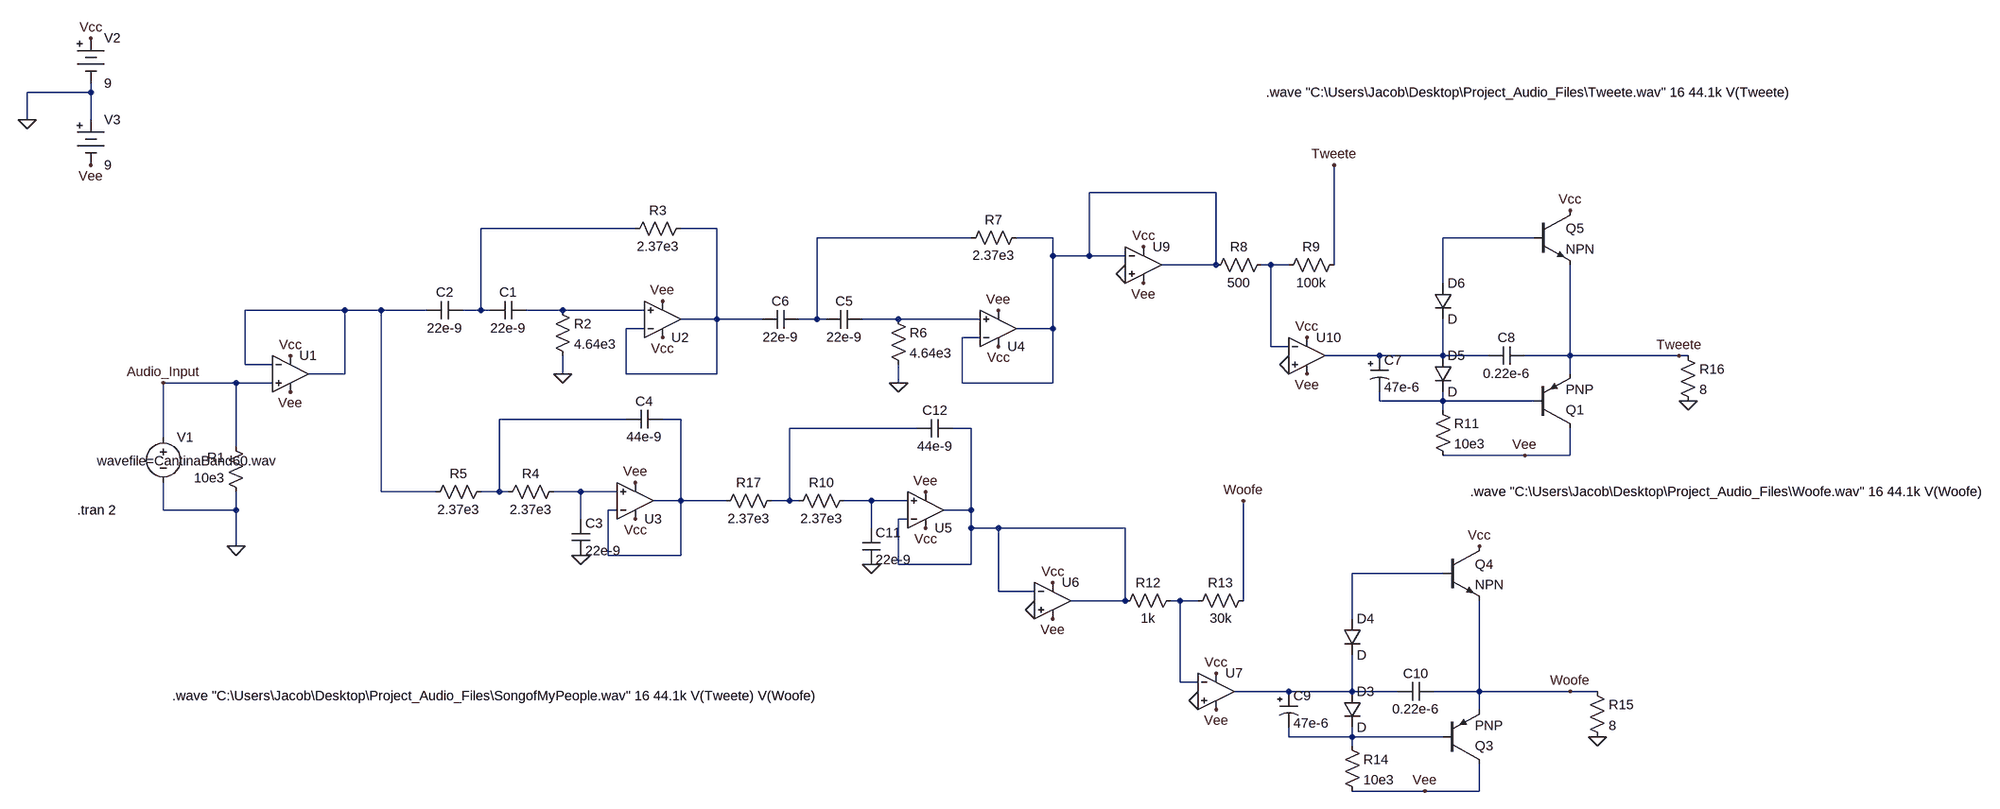
[diagram p0: schematic FinalDesign.asc]
FinalDesign.asc, the LTspice schematic file:
Version 4
SHEET 1 4260 1156
WIRE -96 -288 -96 -304
WIRE -96 -288 -208 -288
WIRE -208 -240 -208 -288
WIRE -96 -240 -96 -288
WIRE 1888 -112 1664 -112
WIRE 864 -48 592 -48
WIRE 1008 -48 944 -48
WIRE 1456 -32 1184 -32
WIRE 1600 -32 1536 -32
WIRE 2448 -32 2288 -32
WIRE 1600 0 1600 -32
WIRE 1664 0 1664 -112
WIRE 1664 0 1600 0
WIRE 1728 0 1664 0
WIRE 1888 16 1888 -112
WIRE 1888 16 1792 16
WIRE 1984 16 1968 16
WIRE 2016 16 1984 16
WIRE 2096 16 2096 -160
WIRE 2288 48 2288 -32
WIRE 352 96 176 96
WIRE 416 96 352 96
WIRE 496 96 416 96
WIRE 592 96 592 -48
WIRE 592 96 560 96
WIRE 608 96 592 96
WIRE 736 96 672 96
WIRE 880 96 736 96
WIRE 1008 112 1008 -48
WIRE 1008 112 944 112
WIRE 1088 112 1008 112
WIRE 1184 112 1184 -32
WIRE 1184 112 1152 112
WIRE 1200 112 1184 112
WIRE 1328 112 1264 112
WIRE 1472 112 1328 112
WIRE 880 128 848 128
WIRE 1600 128 1600 0
WIRE 1600 128 1536 128
WIRE 1472 144 1440 144
WIRE 1984 160 1984 16
WIRE 2016 160 1984 160
WIRE 2176 176 2080 176
WIRE 2288 176 2288 112
WIRE 2288 176 2176 176
WIRE 2368 176 2288 176
WIRE 2512 176 2512 16
WIRE 2512 176 2432 176
WIRE 2704 176 2512 176
WIRE 2720 176 2704 176
WIRE 176 192 176 96
WIRE 224 192 176 192
WIRE 352 208 352 96
WIRE 352 208 288 208
WIRE 736 208 736 176
WIRE 848 208 848 128
WIRE 1008 208 1008 112
WIRE 1008 208 848 208
WIRE 2512 208 2512 176
WIRE 160 224 32 224
WIRE 224 224 160 224
WIRE 1328 224 1328 192
WIRE 1440 224 1440 144
WIRE 1600 224 1600 128
WIRE 1600 224 1440 224
WIRE 2176 256 2176 240
WIRE 2288 256 2288 240
WIRE 2288 256 2176 256
WIRE 2448 256 2288 256
WIRE 2288 272 2288 256
WIRE 848 288 624 288
WIRE 944 288 912 288
WIRE 1360 304 1136 304
WIRE 1456 304 1424 304
WIRE 32 320 32 224
WIRE 160 336 160 224
WIRE 2432 352 2288 352
WIRE 2512 352 2512 304
WIRE 2512 352 2432 352
WIRE 416 416 416 96
WIRE 512 416 416 416
WIRE 624 416 624 288
WIRE 624 416 592 416
WIRE 640 416 624 416
WIRE 768 416 720 416
WIRE 832 416 768 416
WIRE 944 432 944 288
WIRE 944 432 896 432
WIRE 1024 432 944 432
WIRE 1136 432 1136 304
WIRE 1136 432 1104 432
WIRE 1152 432 1136 432
WIRE 1280 432 1232 432
WIRE 1344 432 1280 432
WIRE 32 448 32 400
WIRE 160 448 160 416
WIRE 160 448 32 448
WIRE 832 448 816 448
WIRE 1456 448 1456 304
WIRE 1456 448 1408 448
WIRE 768 464 768 416
WIRE 1344 464 1328 464
WIRE 1280 480 1280 432
WIRE 1456 480 1456 448
WIRE 1504 480 1456 480
WIRE 1728 480 1504 480
WIRE 160 512 160 448
WIRE 816 528 816 448
WIRE 944 528 944 432
WIRE 944 528 816 528
WIRE 1328 544 1328 464
WIRE 1456 544 1456 480
WIRE 1456 544 1328 544
WIRE 2288 560 2128 560
WIRE 1504 592 1504 480
WIRE 1568 592 1504 592
WIRE 1728 608 1728 480
WIRE 1728 608 1632 608
WIRE 1824 608 1808 608
WIRE 1856 608 1824 608
WIRE 1936 608 1936 432
WIRE 2128 640 2128 560
WIRE 1824 752 1824 608
WIRE 1856 752 1824 752
WIRE 2016 768 1920 768
WIRE 2128 768 2128 704
WIRE 2128 768 2016 768
WIRE 2208 768 2128 768
WIRE 2352 768 2352 608
WIRE 2352 768 2272 768
WIRE 2512 768 2352 768
WIRE 2560 768 2512 768
WIRE 2352 800 2352 768
WIRE 2016 848 2016 832
WIRE 2128 848 2128 832
WIRE 2128 848 2016 848
WIRE 2288 848 2128 848
WIRE 2128 864 2128 848
WIRE 2256 944 2128 944
WIRE 2352 944 2352 896
WIRE 2352 944 2256 944
FLAG 160 512 0
FLAG 256 240 Vee
FLAG 256 176 Vcc
FLAG 32 224 Audio_Input
FLAG -208 -240 0
FLAG -96 -160 Vee
FLAG -96 -384 Vcc
FLAG 736 208 0
FLAG 912 80 Vee
FLAG 912 144 Vcc
FLAG 768 528 0
FLAG 864 400 Vee
FLAG 864 464 Vcc
FLAG 1856 784 0
FLAG 2560 848 0
FLAG 1600 640 Vee
FLAG 1888 800 Vee
FLAG 1600 576 Vcc
FLAG 1888 736 Vcc
FLAG 2352 512 Vcc
FLAG 2512 768 Woofe
FLAG 1936 432 Woofe
FLAG 1328 224 0
FLAG 1504 96 Vee
FLAG 1504 160 Vcc
FLAG 2016 192 0
FLAG 2720 256 0
FLAG 1760 48 Vee
FLAG 2048 208 Vee
FLAG 1760 -16 Vcc
FLAG 2048 144 Vcc
FLAG 2512 -80 Vcc
FLAG 2704 176 Tweete
FLAG 2096 -160 Tweete
FLAG 1280 544 0
FLAG 1376 416 Vee
FLAG 1376 480 Vcc
FLAG 1568 624 0
FLAG 2432 352 Vee
FLAG 2256 944 Vee
FLAG 1728 32 0
SYMBOL voltage 32 304 R0
WINDOW 3 -117 58 Left 2
SYMATTR Value wavefile=CantinaBand60.wav
SYMATTR InstName V1
SYMBOL res 176 432 R180
WINDOW 0 36 76 Left 2
WINDOW 3 36 40 Left 2
SYMATTR InstName R1
SYMATTR Value 10e3
SYMBOL OpAmps\\UniversalOpAmp 256 208 R0
SYMATTR InstName U1
SYMBOL Misc\\battery -96 -400 R0
SYMATTR InstName V2
SYMATTR Value 9
SYMBOL Misc\\battery -96 -256 R0
SYMATTR InstName V3
SYMATTR Value 9
SYMBOL OpAmps\\UniversalOpAmp 912 112 M180
SYMATTR InstName U2
SYMBOL res 720 80 R0
SYMATTR InstName R2
SYMATTR Value 4.64e3
SYMBOL cap 672 80 R90
WINDOW 0 0 32 VBottom 2
WINDOW 3 32 32 VTop 2
SYMATTR InstName C1
SYMATTR Value 22e-9
SYMBOL cap 560 80 R90
WINDOW 0 0 32 VBottom 2
WINDOW 3 32 32 VTop 2
SYMATTR InstName C2
SYMATTR Value 22e-9
SYMBOL res 960 -64 R90
WINDOW 0 0 56 VBottom 2
WINDOW 3 32 56 VTop 2
SYMATTR InstName R3
SYMATTR Value 2.37e3
SYMBOL OpAmps\\UniversalOpAmp 864 432 M180
SYMATTR InstName U3
SYMBOL res 736 400 R90
WINDOW 0 0 56 VBottom 2
WINDOW 3 32 56 VTop 2
SYMATTR InstName R4
SYMATTR Value 2.37e3
SYMBOL cap 752 464 R0
SYMATTR InstName C3
SYMATTR Value 22e-9
SYMBOL cap 912 272 R90
WINDOW 0 0 32 VBottom 2
WINDOW 3 32 32 VTop 2
SYMATTR InstName C4
SYMATTR Value 44e-9
SYMBOL res 608 400 R90
WINDOW 0 0 56 VBottom 2
WINDOW 3 32 56 VTop 2
SYMATTR InstName R5
SYMATTR Value 2.37e3
SYMBOL OpAmps\\UniversalOpAmp 1600 608 R0
SYMATTR InstName U6
SYMBOL res 1824 592 R90
WINDOW 0 0 56 VBottom 2
WINDOW 3 32 56 VTop 2
SYMATTR InstName R12
SYMATTR Value 1k
SYMBOL res 1952 592 R90
WINDOW 0 0 56 VBottom 2
WINDOW 3 32 56 VTop 2
SYMATTR InstName R13
SYMATTR Value 30k
SYMBOL OpAmps\\UniversalOpAmp 1888 768 R0
SYMATTR InstName U7
SYMBOL polcap 2000 768 R0
SYMATTR InstName C9
SYMATTR Value 47e-6
SYMBOL diode 2112 768 R0
SYMATTR InstName D3
SYMBOL cap 2272 752 R90
WINDOW 0 0 32 VBottom 2
WINDOW 3 32 32 VTop 2
SYMATTR InstName C10
SYMATTR Value 0.22e-6
SYMBOL res 2112 848 R0
SYMATTR InstName R14
SYMATTR Value 10e3
SYMBOL pnp 2288 896 M180
SYMATTR InstName Q3
SYMBOL npn 2288 512 R0
SYMATTR InstName Q4
SYMBOL res 2544 752 R0
SYMATTR InstName R15
SYMATTR Value 8
SYMBOL diode 2112 640 R0
SYMATTR InstName D4
SYMBOL OpAmps\\UniversalOpAmp 1504 128 M180
SYMATTR InstName U4
SYMBOL res 1312 96 R0
SYMATTR InstName R6
SYMATTR Value 4.64e3
SYMBOL cap 1264 96 R90
WINDOW 0 0 32 VBottom 2
WINDOW 3 32 32 VTop 2
SYMATTR InstName C5
SYMATTR Value 22e-9
SYMBOL cap 1152 96 R90
WINDOW 0 0 32 VBottom 2
WINDOW 3 32 32 VTop 2
SYMATTR InstName C6
SYMATTR Value 22e-9
SYMBOL res 1552 -48 R90
WINDOW 0 0 56 VBottom 2
WINDOW 3 32 56 VTop 2
SYMATTR InstName R7
SYMATTR Value 2.37e3
SYMBOL OpAmps\\UniversalOpAmp 1760 16 R0
SYMATTR InstName U9
SYMBOL res 1984 0 R90
WINDOW 0 0 56 VBottom 2
WINDOW 3 32 56 VTop 2
SYMATTR InstName R8
SYMATTR Value 500
SYMBOL res 2112 0 R90
WINDOW 0 0 56 VBottom 2
WINDOW 3 32 56 VTop 2
SYMATTR InstName R9
SYMATTR Value 100k
SYMBOL OpAmps\\UniversalOpAmp 2048 176 R0
SYMATTR InstName U10
SYMBOL polcap 2160 176 R0
SYMATTR InstName C7
SYMATTR Value 47e-6
SYMBOL diode 2272 176 R0
SYMATTR InstName D5
SYMBOL cap 2432 160 R90
WINDOW 0 0 32 VBottom 2
WINDOW 3 32 32 VTop 2
SYMATTR InstName C8
SYMATTR Value 0.22e-6
SYMBOL res 2272 256 R0
SYMATTR InstName R11
SYMATTR Value 10e3
SYMBOL pnp 2448 304 M180
SYMATTR InstName Q1
SYMBOL npn 2448 -80 R0
SYMATTR InstName Q5
SYMBOL res 2704 160 R0
SYMATTR InstName R16
SYMATTR Value 8
SYMBOL diode 2272 48 R0
SYMATTR InstName D6
SYMBOL OpAmps\\UniversalOpAmp 1376 448 M180
SYMATTR InstName U5
SYMBOL res 1248 416 R90
WINDOW 0 0 56 VBottom 2
WINDOW 3 32 56 VTop 2
SYMATTR InstName R10
SYMATTR Value 2.37e3
SYMBOL cap 1264 480 R0
SYMATTR InstName C11
SYMATTR Value 22e-9
SYMBOL cap 1424 288 R90
WINDOW 0 0 32 VBottom 2
WINDOW 3 32 32 VTop 2
SYMATTR InstName C12
SYMATTR Value 44e-9
SYMBOL res 1120 416 R90
WINDOW 0 0 56 VBottom 2
WINDOW 3 32 56 VTop 2
SYMATTR InstName R17
SYMATTR Value 2.37e3
TEXT -120 448 Left 2 !.tran 2
TEXT 1976 -288 Left 2 !.wave "C:\\Users\\Jacob\\Desktop\\Project_Audio_Files\\Tweete.wav" 16 44.1k V(Tweete)
TEXT 2336 416 Left 2 !.wave "C:\\Users\\Jacob\\Desktop\\Project_Audio_Files\\Woofe.wav" 16 44.1k V(Woofe)
TEXT 48 776 Left 2 !.wave "C:\\Users\\Jacob\\Desktop\\Project_Audio_Files\\SongofMyPeople.wav" 16 44.1k V(Tweete) V(Woofe)

The netlist it stands for:
* FinalDesign.asc
V1 Audio_Input 0 wavefile=CantinaBand60.wav
R1 0 Audio_Input 10e3
XU1 Audio_Input N007 Vcc Vee N007 level1 Avol=1Meg GBW=10Meg Vos=0 En=0 Enk=0 In=0 Ink=0 Rin=500Meg  ; pins In+ In- V+ V- OUT
V2 Vcc 0 9
V3 0 Vee 9
XU2 N008 N003 Vcc Vee N003 level1 Avol=1Meg GBW=10Meg Vos=0 En=0 Enk=0 In=0 Ink=0 Rin=500Meg  ; pins In+ In- V+ V- OUT
R2 N008 0 4.64e3
C1 N008 N002 22e-9
C2 N002 N007 22e-9
R3 N003 N002 2.37e3
XU3 N016 N013 Vcc Vee N013 level1 Avol=1Meg GBW=10Meg Vos=0 En=0 Enk=0 In=0 Ink=0 Rin=500Meg  ; pins In+ In- V+ V- OUT
R4 N016 N012 2.37e3
C3 N016 0 22e-9
C4 N013 N012 44e-9
R5 N012 N007 2.37e3
XU6 0 N015 Vcc Vee N015 level1 Avol=1Meg GBW=10Meg Vos=0 En=0 Enk=0 In=0 Ink=0 Rin=500Meg  ; pins In+ In- V+ V- OUT
R12 N019 N015 1k
R13 Woofe N019 30k
XU7 0 N019 Vcc Vee N020 level1 Avol=1Meg GBW=10Meg Vos=0 En=0 Enk=0 In=0 Ink=0 Rin=500Meg  ; pins In+ In- V+ V- OUT
C9 N020 N021 47e-6
D3 N020 N021 D
C10 Woofe N020 0.22e-6
R14 N021 Vee 10e3
Q3 Vee N021 Woofe 0 PNP
Q4 Vcc N018 Woofe 0 NPN
R15 Woofe 0 8
D4 N018 N020 D
XU4 N009 N001 Vcc Vee N001 level1 Avol=1Meg GBW=10Meg Vos=0 En=0 Enk=0 In=0 Ink=0 Rin=500Meg  ; pins In+ In- V+ V- OUT
R6 N009 0 4.64e3
C5 N009 N004 22e-9
C6 N004 N003 22e-9
R7 N001 N004 2.37e3
XU9 0 N001 Vcc Vee N001 level1 Avol=1Meg GBW=10Meg Vos=0 En=0 Enk=0 In=0 Ink=0 Rin=500Meg  ; pins In+ In- V+ V- OUT
R8 N006 N001 500
R9 Tweete N006 100k
XU10 0 N006 Vcc Vee N010 level1 Avol=1Meg GBW=10Meg Vos=0 En=0 Enk=0 In=0 Ink=0 Rin=500Meg  ; pins In+ In- V+ V- OUT
C7 N010 N011 47e-6
D5 N010 N011 D
C8 Tweete N010 0.22e-6
R11 N011 Vee 10e3
Q1 Vee N011 Tweete 0 PNP
Q5 Vcc N005 Tweete 0 NPN
R16 Tweete 0 8
D6 N005 N010 D
XU5 N017 N015 Vcc Vee N015 level1 Avol=1Meg GBW=10Meg Vos=0 En=0 Enk=0 In=0 Ink=0 Rin=500Meg  ; pins In+ In- V+ V- OUT
R10 N017 N014 2.37e3
C11 N017 0 22e-9
C12 N015 N014 44e-9
R17 N014 N013 2.37e3
.model D D
.lib standard.dio
.model NPN NPN
.model PNP PNP
.lib standard.bjt
.tran 2
.wave "C:\Users\Jacob\Desktop\Project_Audio_Files\Tweete.wav" 16 44.1k V(Tweete)
.wave "C:\Users\Jacob\Desktop\Project_Audio_Files\Woofe.wav" 16 44.1k V(Woofe)
.wave "C:\Users\Jacob\Desktop\Project_Audio_Files\SongofMyPeople.wav" 16 44.1k V(Tweete) V(Woofe)
.lib UniversalOpAmp1.lib
.backanno
.end